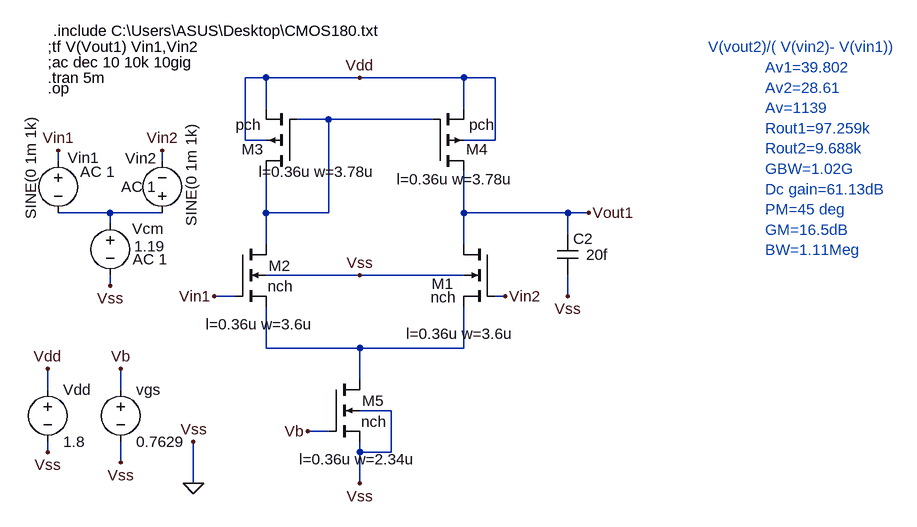
[diagram p0: schematic final design one stage opamp.asc]
final design one stage opamp.asc, the LTspice schematic file:
Version 4
SHEET 1 1412 680
WIRE 368 -160 336 -160
WIRE 512 -160 368 -160
WIRE 672 -160 512 -160
WIRE 720 -160 672 -160
WIRE 368 -112 368 -160
WIRE 672 -112 672 -160
WIRE 464 -96 416 -96
WIRE 624 -96 464 -96
WIRE 336 -64 336 -160
WIRE 368 -64 336 -64
WIRE 720 -64 720 -160
WIRE 720 -64 672 -64
WIRE 48 -32 48 -48
WIRE 208 -32 208 -48
WIRE 128 48 48 48
WIRE 208 48 128 48
WIRE 368 48 368 -16
WIRE 464 48 464 -96
WIRE 464 48 368 48
WIRE 672 48 672 -16
WIRE 832 48 672 48
WIRE 864 48 832 48
WIRE 128 64 128 48
WIRE 832 80 832 48
WIRE 368 96 368 48
WIRE 672 96 672 48
WIRE 512 144 368 144
WIRE 672 144 512 144
WIRE 128 160 128 144
WIRE 320 176 288 176
WIRE 736 176 720 176
WIRE 832 176 832 144
WIRE 368 256 368 192
WIRE 512 256 368 256
WIRE 672 256 672 192
WIRE 672 256 512 256
WIRE 512 304 512 256
WIRE 32 320 32 288
WIRE 144 320 144 288
WIRE 560 352 512 352
WIRE 464 384 432 384
WIRE 32 416 32 400
WIRE 512 416 512 400
WIRE 560 416 560 352
WIRE 560 416 512 416
WIRE 144 432 144 400
WIRE 256 464 256 400
WIRE 512 464 512 416
FLAG 256 464 0
FLAG 256 400 Vss
FLAG 32 416 Vss
FLAG 128 160 Vss
FLAG 32 288 Vdd
FLAG 736 176 Vin2
FLAG 288 176 Vin1
FLAG 512 -160 Vdd
FLAG 512 144 Vss
FLAG 48 -48 Vin1
FLAG 208 -48 Vin2
FLAG 144 288 Vb
FLAG 144 432 Vss
FLAG 864 48 Vout1
FLAG 432 384 Vb
FLAG 512 464 Vss
FLAG 832 176 Vss
SYMBOL nmos4 720 96 M0
WINDOW 0 64 61 Left 2
WINDOW 3 60 82 Left 2
WINDOW 123 -29 138 Left 2
SYMATTR InstName M1
SYMATTR Value nch
SYMATTR Value2 l=0.36u w=3.6u
SYMBOL voltage 32 304 R0
WINDOW 123 0 0 Left 0
WINDOW 39 0 0 Left 0
SYMATTR InstName Vdd
SYMATTR Value 1.8
SYMBOL voltage 128 48 R0
WINDOW 3 37 51 Left 2
WINDOW 123 35 71 Left 2
WINDOW 39 0 0 Left 0
WINDOW 0 34 24 Left 2
SYMATTR Value 1.19
SYMATTR Value2 AC 1
SYMATTR InstName Vcm
SYMBOL pmos4 624 -16 M180
WINDOW 123 -55 -12 Left 2
WINDOW 0 52 34 Left 2
SYMATTR Value2 l=0.36u w=3.78u
SYMATTR InstName M4
SYMATTR Value pch
SYMBOL nmos4 320 96 R0
WINDOW 0 52 33 Left 2
WINDOW 3 50 65 Left 2
WINDOW 123 -45 123 Left 2
SYMATTR InstName M2
SYMATTR Value nch
SYMATTR Value2 l=0.36u w=3.6u
SYMBOL voltage 48 -48 R0
WINDOW 0 15 11 Left 2
WINDOW 3 -42 -52 VRight 2
WINDOW 123 34 33 Left 2
WINDOW 39 0 0 Left 0
SYMATTR InstName Vin1
SYMATTR Value SINE(0 1m 1k)
SYMATTR Value2 AC 1
SYMBOL voltage 208 64 M180
WINDOW 0 -57 100 Left 2
WINDOW 3 45 153 VLeft 2
WINDOW 123 -63 56 Left 2
WINDOW 39 0 0 Left 0
SYMATTR InstName Vin2
SYMATTR Value SINE(0 1m 1k)
SYMATTR Value2 AC 1
SYMBOL voltage 144 304 R0
WINDOW 123 0 0 Left 0
WINDOW 39 0 0 Left 0
SYMATTR InstName vgs
SYMATTR Value 0.7629
SYMBOL pmos4 416 -16 R180
WINDOW 123 -120 -1 Left 2
WINDOW 0 52 34 Left 2
SYMATTR Value2 l=0.36u w=3.78u
SYMATTR InstName M3
SYMATTR Value pch
SYMBOL nmos4 464 304 R0
WINDOW 0 52 33 Left 2
WINDOW 3 50 65 Left 2
WINDOW 123 -45 123 Left 2
SYMATTR InstName M5
SYMATTR Value nch
SYMATTR Value2 l=0.36u w=2.34u
SYMBOL cap 816 80 R0
WINDOW 3 44 32 Left 2
SYMATTR Value 20f
SYMATTR InstName C2
TEXT 40 -232 Left 2 !.include C:\\Users\\ASUS\\Desktop\\CMOS180.txt
TEXT 32 -144 Left 2 !.op
TEXT 32 -208 Left 2 !;tf V(Vout1) Vin1,Vin2
TEXT 32 -184 Left 2 !;ac dec 10 10k 10gig
TEXT 32 -160 Left 2 !.tran 5m
TEXT 1048 -208 Left 2 ;V(vout2)/( V(vin2)- V(vin1))
TEXT 1136 -176 Left 2 ;Av1=39.802\nAv2=28.61\nAv=1139\nRout1=97.259k\nRout2=9.688k\nGBW=1.02G\nDc gain=61.13dB\nPM=45 deg\nGM=16.5dB\nBW=1.11Meg

The netlist it stands for:
* final design one stage opamp.asc
M1 Vout1 Vin2 N003 0 nch l=0.36u w=3.6u
Vdd Vdd 0 1.8
Vcm N002 0 1.19 AC 1
M4 Vout1 N001 Vdd Vdd pch l=0.36u w=3.78u
M2 N001 Vin1 N003 0 nch l=0.36u w=3.6u
Vin1 Vin1 N002 SINE(0 1m 1k) AC 1
Vin2 N002 Vin2 SINE(0 1m 1k) AC 1
vgs Vb 0 0.7629
M3 N001 N001 Vdd Vdd pch l=0.36u w=3.78u
M5 N003 Vb 0 0 nch l=0.36u w=2.34u
C2 Vout1 0 20f
.model NMOS NMOS
.model PMOS PMOS
.lib standard.mos
.include C:\Users\ASUS\Desktop\CMOS180.txt
.op
;tf V(Vout1) Vin1,Vin2
;ac dec 10 10k 10gig
.tran 5m
* V(vout2)/( V(vin2)- V(vin1))
* Av1=39.802
* Av2=28.61
* Av=1139
* Rout1=97.259k
* Rout2=9.688k
* GBW=1.02G
* Dc gain=61.13dB
* PM=45 deg
* GM=16.5dB
* BW=1.11Meg
.backanno
.end